# EAGLE design pPump3 (EAGLE 8.2.0)
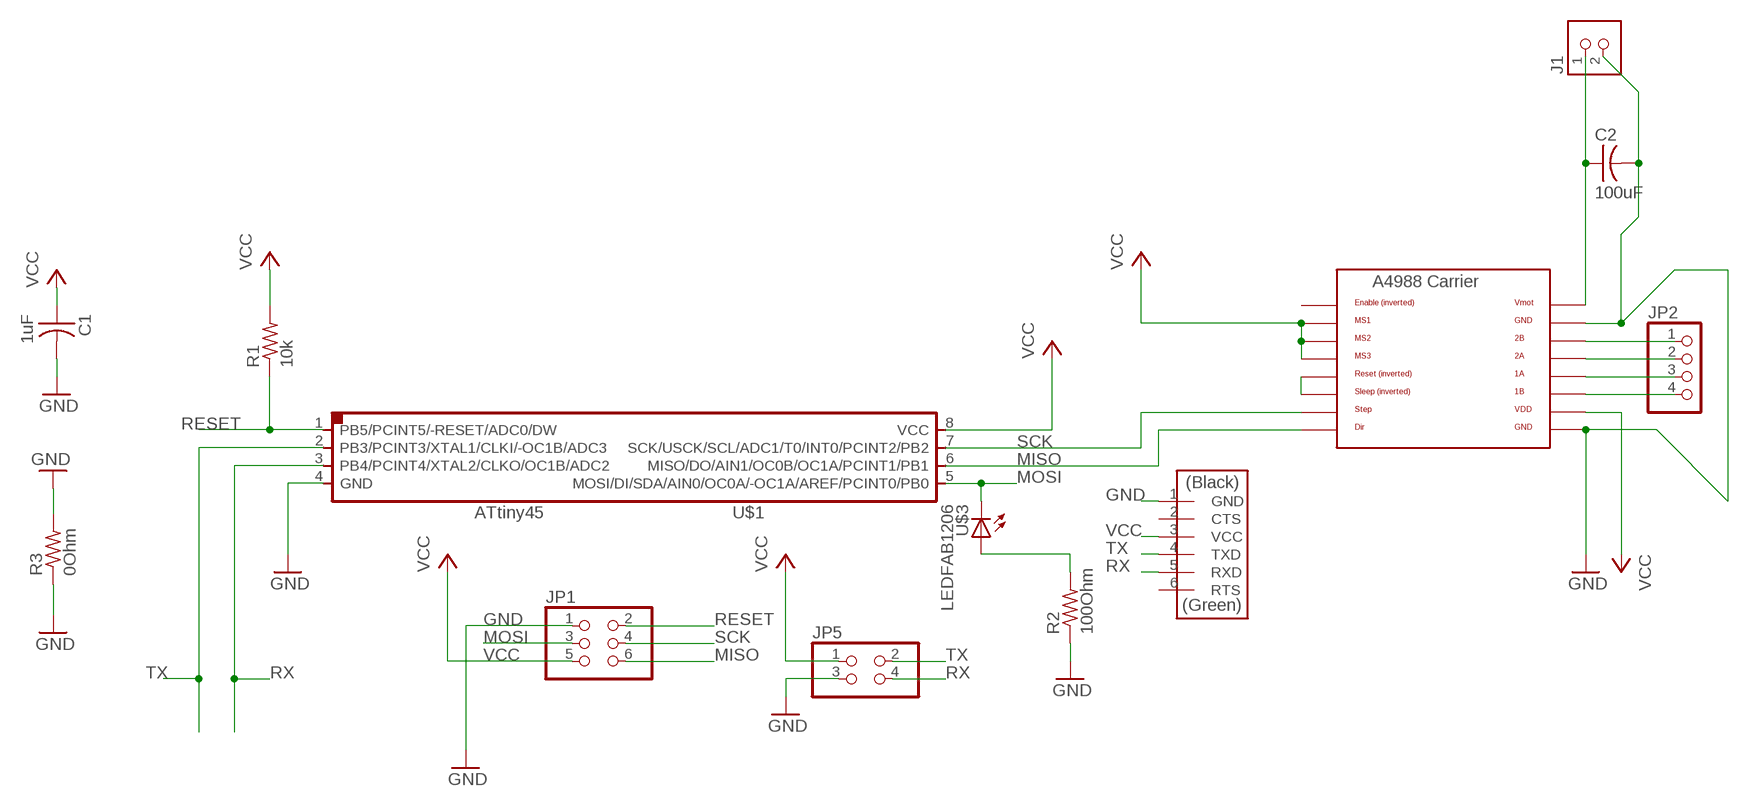
[diagram p0: schematic, sheet 1]

## Parts
C1  1uF  CAP-US1206FAB  [C1206FAB]
C2  100uF  CAP-US1206FAB  [C1206FAB]
J1  TERM-1X02-FABLAB  [ED555DS-2DS]
JP1  PINHD-2X3-SMD  [2X03SMD]
JP2  PINHD-1X4  [1X04]
JP5  PINHD-2X02_2.54-SMD  [2X02SMD]
R1  10k  RES-US1206FAB  [R1206FAB]
R2  100Ohm  RES-US1206FAB  [R1206FAB]
R3  0Ohm  RES-US1206FAB  [R1206FAB]
U$1  ATTINY45SI  [SOIC8]
U$2  FTDI-SMD-HEADER  [1X06SMD]
U$3  LEDFAB1206  [LED1206FAB]
U$4  A4988BREAKOUT_CNC  [A4988BREAKOUT]

## Nets
GND: C1.2 JP1.1 JP5.3 R2.1 R3.1 R3.2 U$1.4(GND) U$2.1(GND)
MISO: JP1.6 U$1.6(MISO/DO/AIN1/OC0B/OC1A/PCINT1/PB1) U$4.DIR
MOSI: JP1.3 U$1.5(MOSI/DI/SDA/AIN0/OC0A/-OC1A/AREF/PCINT0/PB0) U$3.2(C)
N$1: R2.2 U$3.1(A)
N$4: JP2.1 U$4.2B
N$5: JP2.2 U$4.2A
N$6: JP2.3 U$4.1A
N$7: JP2.4 U$4.1B
N$8: C2.2 J1.2 U$4.GND U$4.GND@0(GND)
N$13: C2.1 J1.1 U$4.VMOT
N$14: U$4.RST U$4.SLP(SLEEP)
RESET: JP1.2 R1.1 U$1.1(PB5/PCINT5/-RESET/ADC0/DW)
RX: JP5.4 U$1.3(PB4/PCINT4/XTAL2/CLKO/OC1B/ADC2) U$2.5(RXD)
SCK: JP1.4 U$1.7(SCK/USCK/SCL/ADC1/T0/INT0/PCINT2/PB2) U$4.STEP
TX: JP5.2 U$1.2(PB3/PCINT3/XTAL1/CLKI/-OC1B/ADC3) U$2.4(TXD)
VCC: C1.1 JP1.5 JP5.1 R1.2 U$1.8(VCC) U$2.3(VCC) U$4.MS1 U$4.MS2 U$4.MS3 U$4.VDD
Unconnected: U$2.2(CTS) U$2.6(RTS) U$4.EN

## Library data of the parts
C1 C2 = fab:CAP-US
J1 = fab:TERM-1X02: 3.5mm terminal block, 2 positions ED555-2DS as found in the fablab inventory. Stolen from Adafruit <http://www.ladyada.net/library/pcb/eaglelibrary.html>, adapted by Zaerc.
JP1 = fab:PINHD-2X3-SMD: PIN HEADER
JP2 = RepRapjr:PINHD-1X4: PIN HEADER
JP5 = untitled:PINHD-2X02: PIN HEADER
R1-R3 = fab:RES-US: Resistor (US Symbol) Variants with postfix FAB are widened to allow the routing of internal traces
U$1 = fab:ATTINY45
U$2 = fab:FTDI-SMD-HEADER
U$3 = fab:LED: LED
U$4 = RepRapjr:A4988BREAKOUT_CNC

## Board
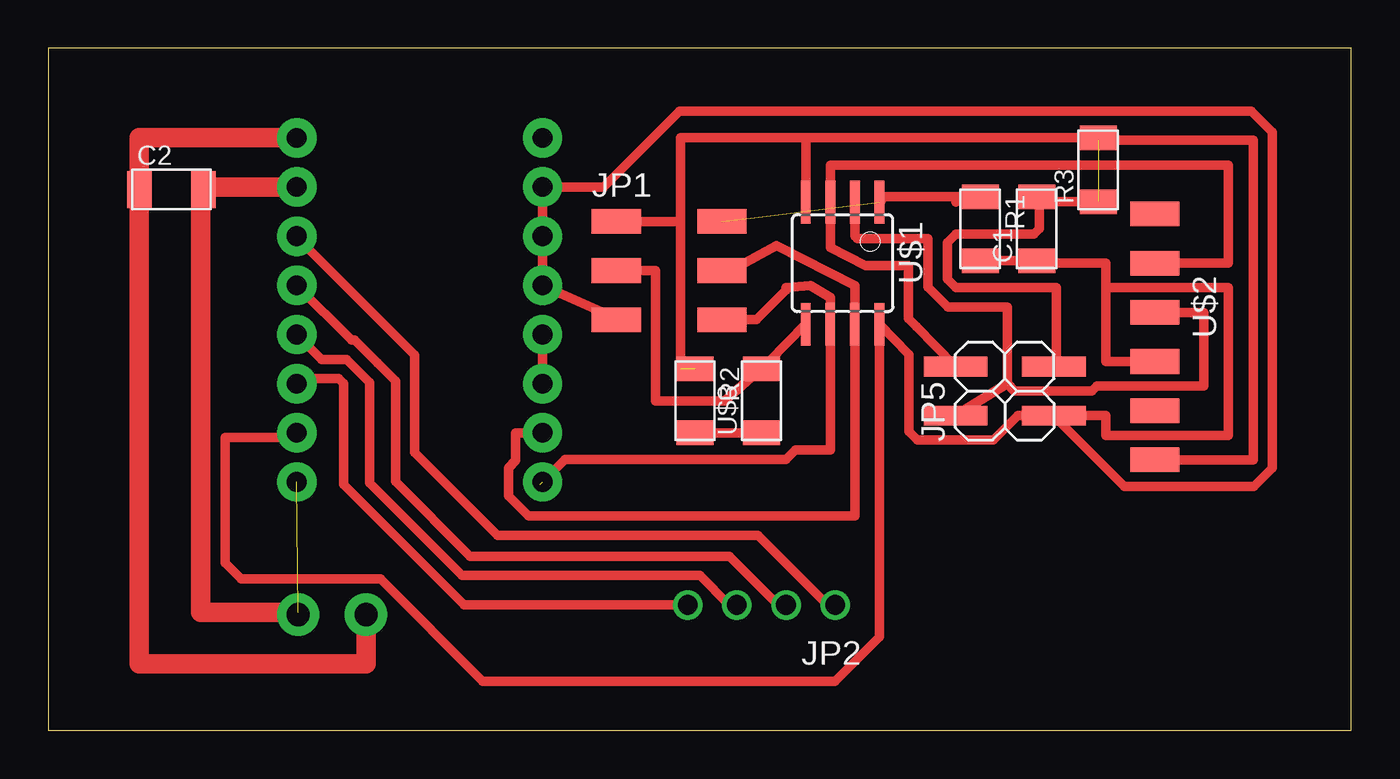
[diagram p1: board, top side]
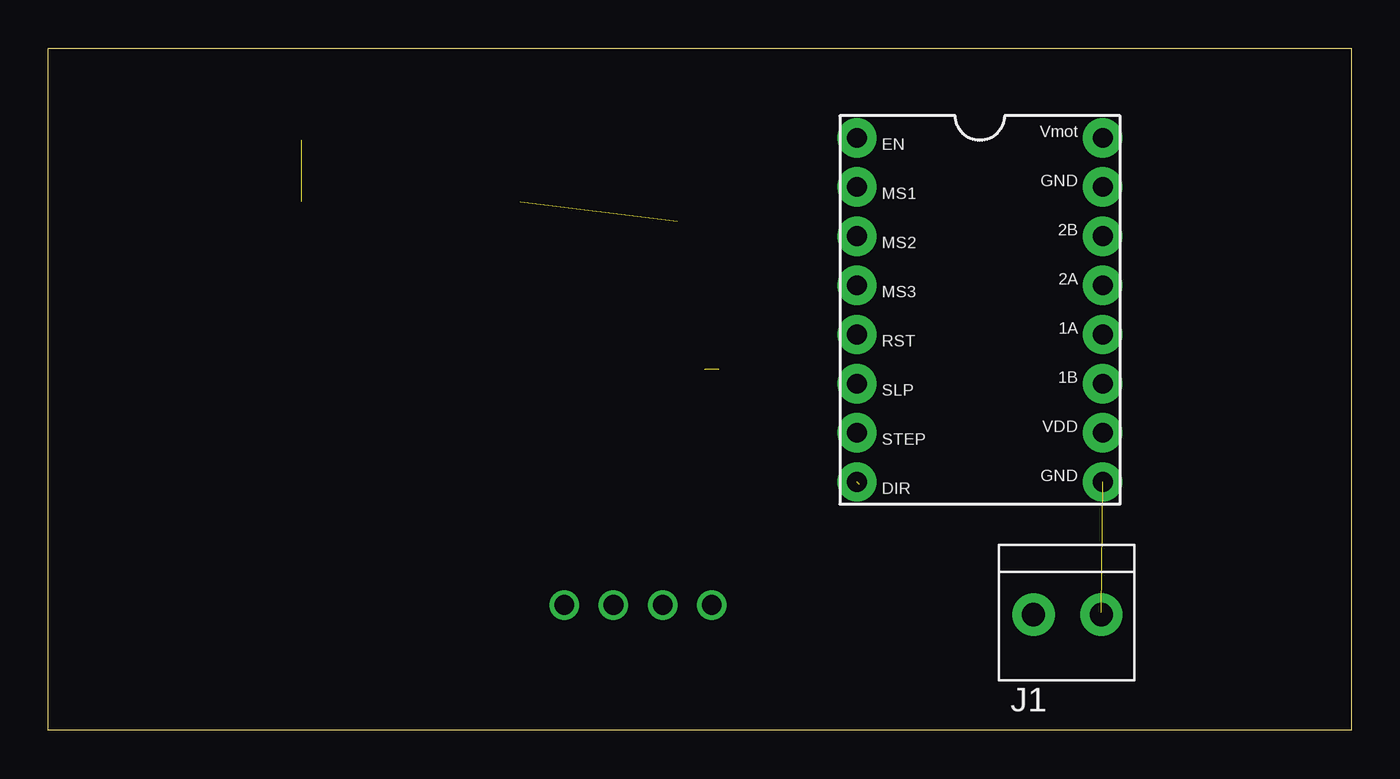
[diagram p2: board, bottom side, seen from below]

Size 67.29 x 35.23 mm. Coordinates in mm from the lower left corner, seen from the top.
Outline: 0,0 67.29,0 67.29,35.23 0,35.23 0,0
Copper layers (1*16): Top 0.035mm / dielectric 1.5mm / Bottom 0.035mm
Design rules "default *": minimum track width 0.5mm, minimum drill 0.35mm, track to track 0.5mm, track to pad 0.5mm, pad to pad 0.5mm, via to via 0.5mm, smd to smd 0.5mm, copper to edge 0.5mm, drill to drill 6mil, minimum pad ring 10mil, minimum via ring 8mil, stop-mask expansion 4mil, vias tented up to drill 0mil, thermal gap 0.4mm

### Footprints (pad centres in the part's own frame; a part is rotated, then mirrored left to right if it is on the bottom)
C1206FAB = smd 1.27 x 1.905: 1 -1.651,0; 2 1.651,0
ED555DS-2DS = drill 1.2 pad 2.184: 1 1.8,0; 2 -1.7,0
2X03SMD = smd 2.54 x 1.27: 1 -2.54,2.54; 2 2.92,2.54; 3 -2.54,0; 4 2.92,0; 5 -2.54,-2.54; 6 2.92,-2.54
1X04 = drill 1.016: 1 -2.54,0; 2 0,0; 3 2.54,0; 4 5.08,0
2X02SMD = smd 1.016 x 3.302: 1 -1.27,-3.81; 2 -1.27,1.27; 3 1.27,-3.81; 4 1.27,1.27
R1206FAB = smd 1.27 x 1.905: 1 -1.651,0; 2 1.651,0
SOIC8 = smd 0.5 x 2.2: 1 -1.905,-3.154; 2 -0.645,-3.154; 3 0.625,-3.154; 4 1.895,-3.154; 5 1.905,3.154; 6 0.635,3.154; 7 -0.635,3.154; 8 -1.905,3.154
1X06SMD = smd 2.54 x 1.27: 1 0,6.35; 2 0,3.81; 3 0,1.27; 4 0,-1.27; 5 0,-3.81; 6 0,-6.35
LED1206FAB = smd 1.27 x 1.905: 1 -1.651,0; 2 1.651,0
A4988BREAKOUT = drill 1.016 pad 2.032: 1A 8.89,1.27; 1B 11.43,1.27; 2A 6.35,1.27; 2B 3.81,1.27; DIR 16.51,-11.43; EN -1.27,-11.43; GND 16.51,1.27; GND@0 1.27,1.27; MS1 1.27,-11.43; MS2 3.81,-11.43; MS3 6.35,-11.43; RST 8.89,-11.43; SLP 11.43,-11.43; STEP 13.97,-11.43; VDD 13.97,1.27; VMOT -1.27,1.27

### Placement (x,y rotation side)
C1  51.05,25.91 90 top
C2  6.35,27.94 0 top
J1  14.61,5.97 180 bottom
JP1  31.88,23.75 0 top
JP2  38.1,6.48 180 top
JP5  48.13,17.53 90 top
R1  48.13,25.91 270 top
R2  33.4,17.02 270 top
R3  54.23,28.96 90 top
U$1  41.02,24.13 180 top
U$2  57.15,20.32 180 top
U$3  36.83,17.02 90 top
U$4  14.1,29.34 270 bottom

### Tracks (layer width: path | path; a pad name or v marks a point on that pad's centre or on a via)
GND  (2 unrouted)
  Top 0.5: R3.1 51.05,27.3 C1.2 51.18,27.05 51.18,25.91 50.91,25.64 46.87,25.64 46.43,25.2 46.43,23.31 46.88,22.86 52.07,22.86 52.07,18.8 | JP1.1 32.64,26.29 | 32.64,26.29 32.64,18.67 | 32.64,26.29 32.64,30.61 35.56,30.61 39.13,30.61 | U$1.4 39.13,30.61 | 39.13,30.61 R3.2 54.23,30.48 62.23,30.48 62.23,13.97 U$2.1 | 51.05,18.8 JP5.3 | JP5.3 52.07,18.8 | JP5.3 52.07,18.8
MISO  (1 unrouted)
  Top 0.5: JP1.6 36.58,21.21 38.1,22.73 38.1,22.86 39.37,22.99 40.39,22.35 U$1.6 40.39,14.48 38.59,14.48 38.09,13.98 26.68,13.98 25.4,12.7
MOSI
  Top 0.5: JP1.3 31.37,23.75 31.37,17.02 34.92,17.02 37.21,19.05 | 37.21,19.05 U$1.5 | 37.21,19.05 U$3.2
N$1
  Top 0.5: U$3.1 R2.2 | R2.2 33.02,15.37 33.02,15.24 33.4,15.24 R2.2
N$4
  Top 0.5: JP2.1 40.24,6.48 36.65,10.06 23.21,10.06 18.92,14.35 18.92,19.39 12.83,25.48 U$4.2B
N$5
  Top 0.5: JP2.2 37.7,6.48 35.19,8.99 21.78,8.99 17.92,12.84 17.92,18.05 17,18.98 | 17,18.98 | U$4.2A 15.65,20.16 15.81,20.16 17,18.98
N$6
  Top 0.5: JP2.3 35.16,6.48 33.65,7.99 21.36,7.99 16.58,12.77 16.58,17.98 15.4,19.16 14.11,19.16 U$4.1A
N$7
  Top 0.5: JP2.4 21.46,6.48 15.24,12.7 15.24,17.91 14.99,18.16 13.08,18.16 U$4.1B
N$8  (1 unrouted)
  Top 1: C2.2 8,27.81 | C2.2 7.87,27.94 7.87,6.1 12.9,6.1 J1.2 | U$4.GND@0 8,28.07 C2.2
N$13
  Top 1: J1.1 16.41,3.43 4.7,3.43 C2.1 4.7,30.61 U$4.VMOT
N$14
  Top 0.5: U$4.SLP U$4.RST
RESET  (1 unrouted)
  Top 0.5: 46.88,27.28 arc-90 R1.1 43.03,27.56 arc-90 U$1.1
RX
  Top 0.5: U$2.5 60.96,24.13 60.96,29.21 40.4,29.21 U$1.3 40.4,24.93 42.2,24.02 44.43,24.02 44.43,21.27 44.83,20.87 JP5.4
SCK
  Top 0.5: U$4.STEP 24.13,15.37 24.13,13.93 23.76,13.56 23.76,12.1 24.8,11.06 41.66,11.06 U$1.7 41.66,22.1 41.67,22.99 37.61,25.05 35.45,23.86 35.31,24 34.8,24 JP1.4
TX
  Top 0.5: 56.56,21.59 U$2.4 59.69,21.59 59.69,17.78 54.15,17.78 53.91,17.54 49.9,17.54 49.53,17.91 | 49.53,17.91 JP5.2 | 49.53,17.91 49.53,21.86 46.47,21.86 45.43,22.9 45.43,25.4 41.79,25.4 41.75,25.43 41.75,25.44 41.67,25.53 U$1.2
VCC
  Top 0.5: 50.8,24.26 R1.2 | 50.8,24.26 C1.1 | U$2.3 54.61,19.05 54.61,22.86 | 54.61,22.86 54.61,24.13 50.8,24.13 50.8,24.26 | 54.61,22.86 60.96,22.86 60.96,15.24 54.61,15.24 54.61,16.26 JP5.1 51.9,16.26 | JP1.5 29.46,21.21 U$4.MS3 U$4.MS2 U$4.MS1 28.68,28.07 32.61,31.99 62.13,31.99 63.23,30.89 63.23,13.56 62.26,12.59 55.57,12.59 51.9,16.26 | U$4.VDD 12.59,15.13 9.12,15.13 9.12,8.66 9.97,7.81 17.17,7.81 22.44,2.54 40.64,2.54 42.93,4.83 U$1.8 44.46,19.41 44.46,15.44 44.9,15 48.83,15 50.08,16.26 51.9,16.26